# EasyEDA Pro project ProPrj_Attiny1616 Devboard_2024-11-25.epro

# Schematic Schematic1
Board Name: Board1; Create Date: 2024-11-01; Page Name: P1; Project Name: Attiny1616 Devboard; Schematic Name: Schematic1; Update Date: 2024-11-01; Company: EasyEDA.com; Drawn: EasyEDA; Page Size: A4; Part Number: JLCPCB-002; Reviewed: EasyEDA; Version: V0.1
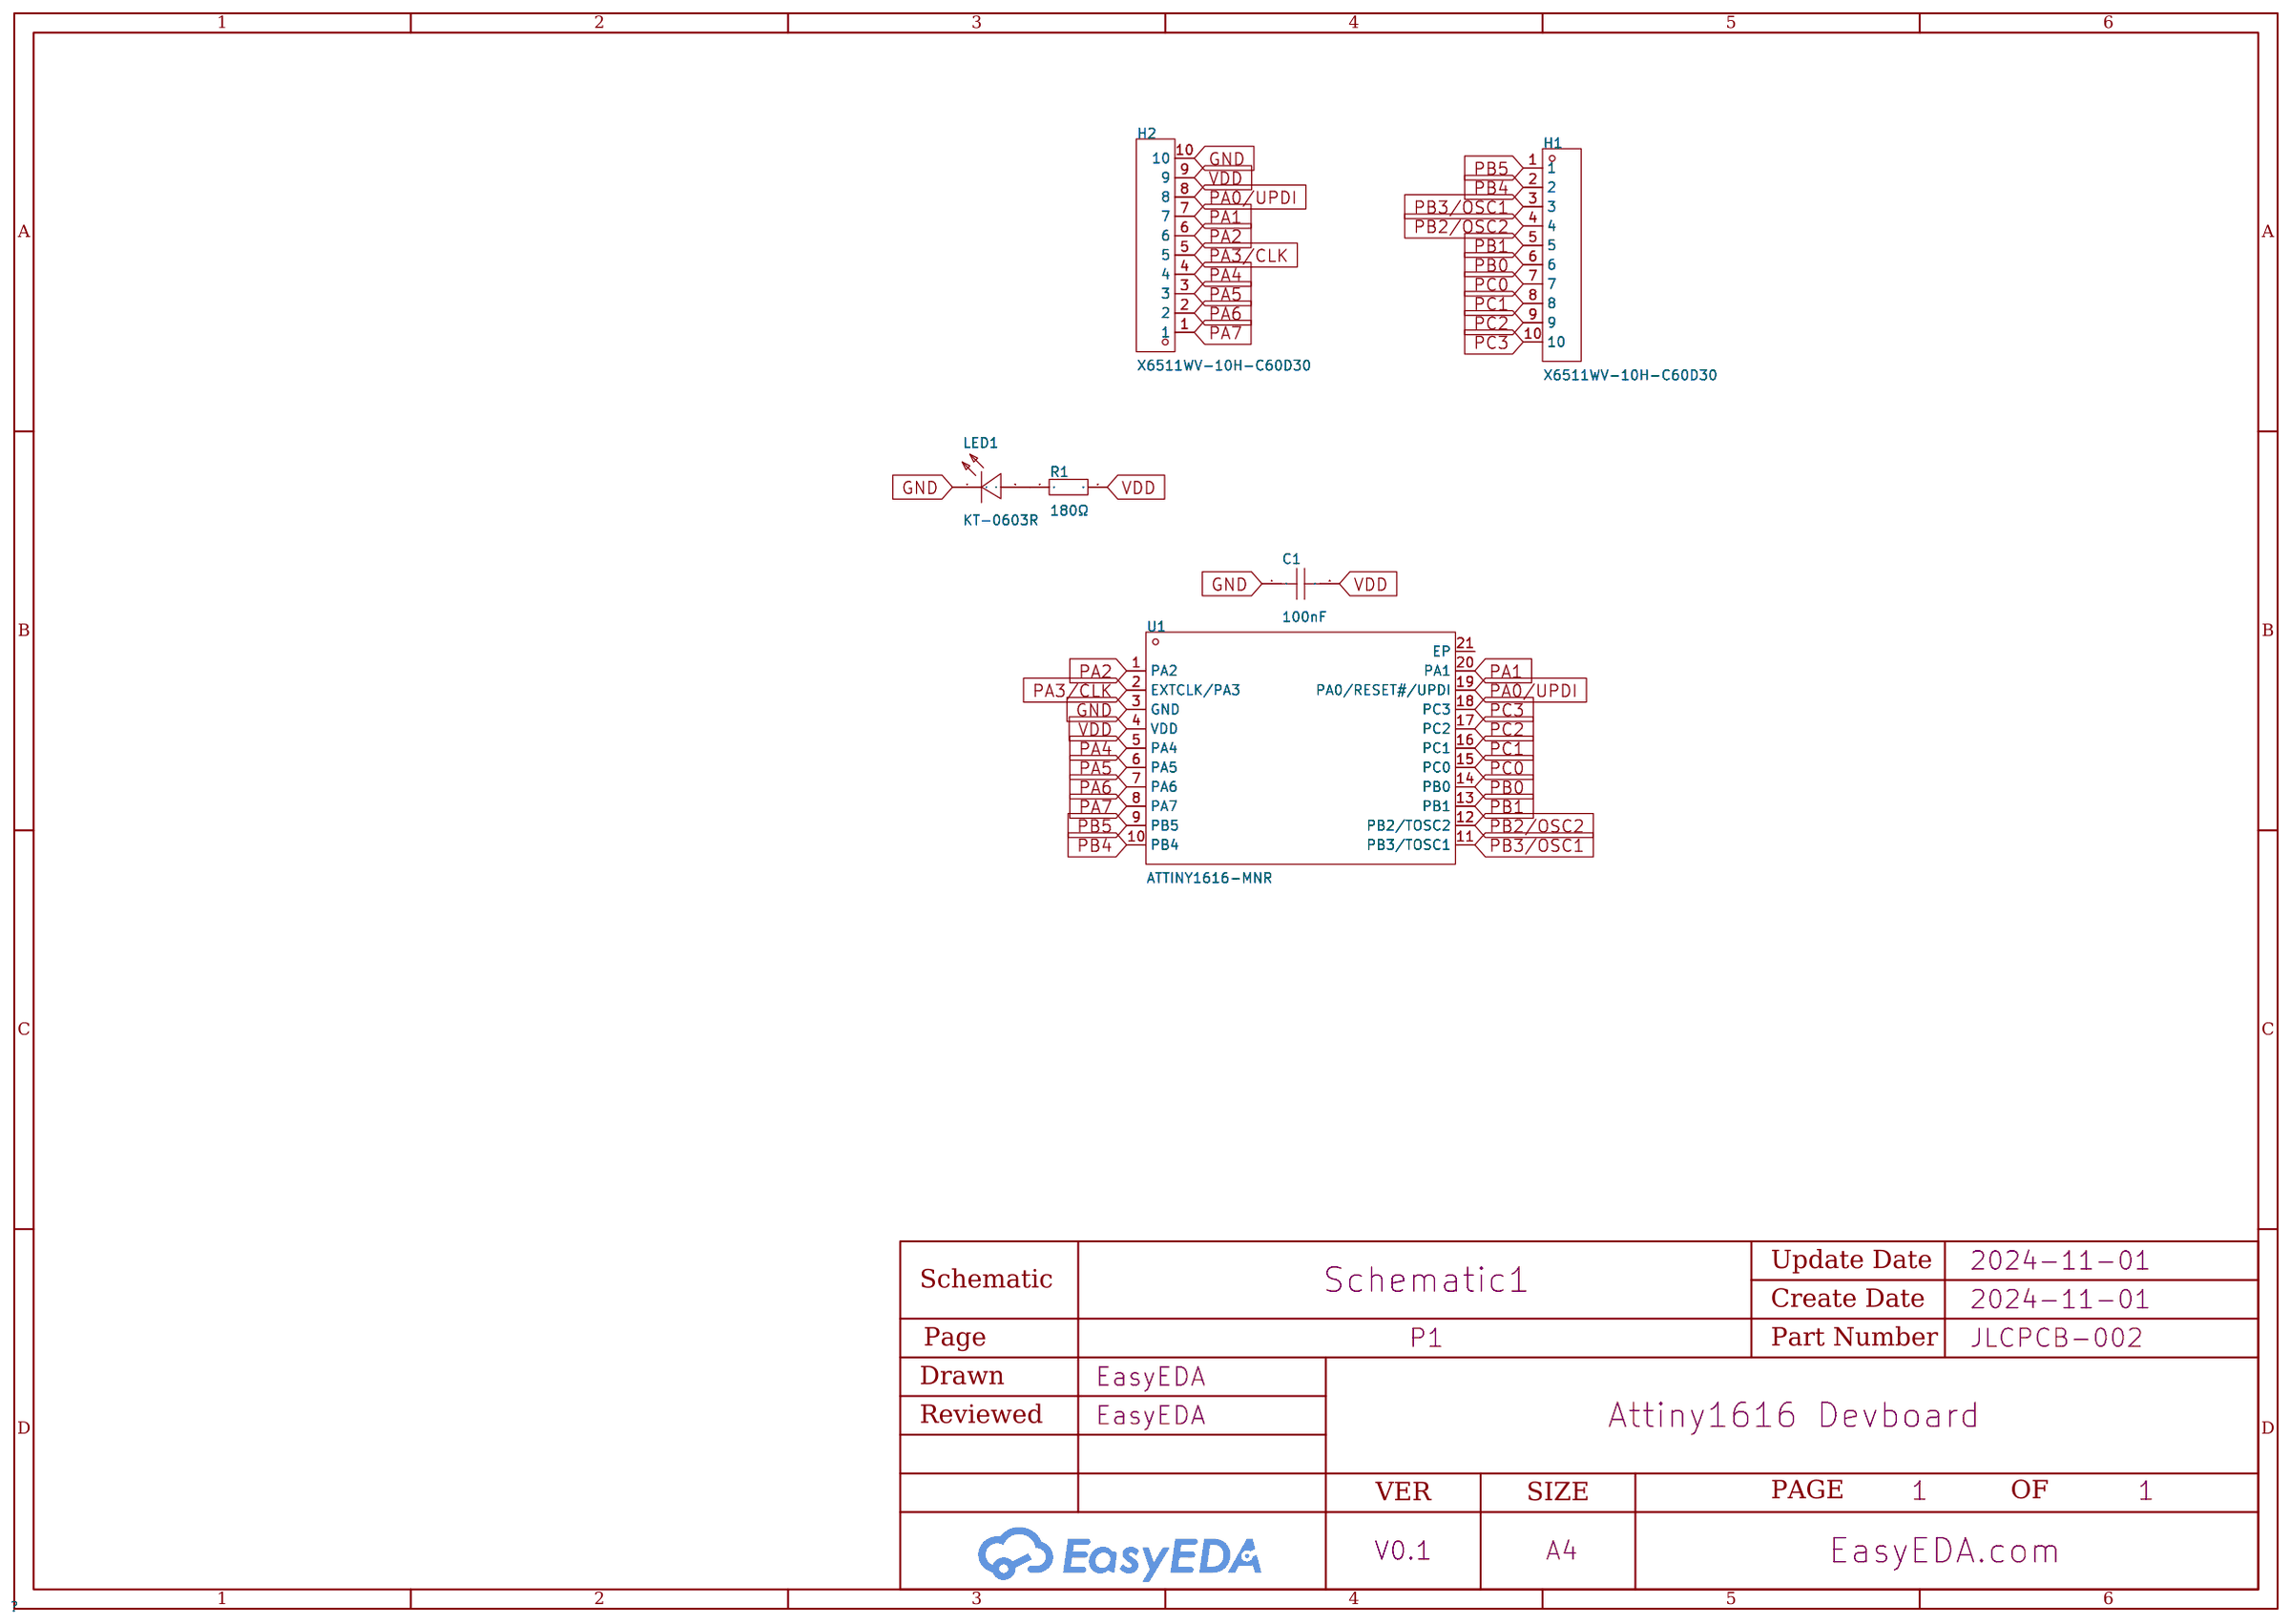
[diagram p0: schematic sheet]

## Parts
C1  100nF  [C0402]
H1  X6511WV-10H-C60D30  [HDR-TH_10P-P2.54-V-M]
H2  X6511WV-10H-C60D30  [HDR-TH_10P-P2.54-V-M]
LED1  KT-0603R  [LED0603-RD]
R1  180Ω  [R0603]
U1  ATTINY1616-MNR  [QFN-20_L3.0-W3.0-P0.40-BL-EP1.7]

## Library data of the parts
C1 = CL05B104KO5NNNC: Capacitance: Tolerance:±10% Tolerance:±10% Voltage Rated: Temperature Coefficient:; LCSC Part Name: 100nF ±10% 16V; Supplier Part: C1525; Manufacturer: SAMSUNG(三星); Supplier Footprint: 0402; JLCPCB Part Class: Basic Part; Datasheet: https://atta.szlcsc.com/upload/public/pdf/source/20160218/1457707763339.pdf; Supplier: LCSC; Tolerance: ±10%
H1 H2 = X6511WV-10H-C60D30: Pin Structure:1x10P Pitch:2.54mm Row Spacing:2.54mm Circluar Pins/Square Pins:Square Pins Mounting Type:- Number of Rows:Plugin Number of Pins:10P Current Rating (Max):3A Voltage Rating (Max):250V Length of Mating Pin:- Insulation Height:2.5mm Length of E; LCSC Part Name: 1x10P 间距:2.54mm 方针; Supplier Part: C706882; Manufacturer: XKB Connection(中国星坤); Supplier Footprint: 插件,P=2.54mm; JLCPCB Part Class: Extended Part; Datasheet: https://atta.szlcsc.com/upload/public/pdf/source/20230721/6983A48291A2C750717C95FB3D973894.pdf; Supplier: LCSC; Pin Structure: 1x10P; Pitch: 2.54mm; Row Spacing: 2.54mm; Circluar Pins/Square Pins: Square Pins; Number of Rows: Plugin; Number of Pins: 10P; Current Rating (Max): 3A; Voltage Rating (Max): 250V; Insulation Height: 2.5mm; Contact Plating: Gold; Operating Temperature Range: -40℃~+105℃; Soldering Temperature(Max): 260℃; Color: Black
LED1 = KT-0603R: Emitted Color:Red Power Dissipation:- Forward Current:- Dominant Wavelength:- Dominant Wavelength:- Peak Wavelength:- Diode Configuration:- Lens Color:- Color Temperature:- Color Temperature:- Viewing Angle:- Mounting Sytle:- Operating Temperature:-40℃~+8; LCSC Part Name: 0603 红灯 高亮; Supplier Part: C2286; Manufacturer: KENTO; Supplier Footprint: 0603; JLCPCB Part Class: Basic Part; Datasheet: https://atta.szlcsc.com/upload/public/pdf/source/20160616/1466072038404.pdf; Supplier: LCSC; Emitted Color: Red; Operating Temperature: -40℃~+85℃
R1 = RC0603FR-07180RL: Type:Thick Film Resistors Resistance: Tolerance:±1% Tolerance:±1% Power(Watts): Overload Voltage (Max): Temperature Coefficient:±100ppm/℃ Temperature Coefficient:±100ppm/℃ Operating Temperature Range:-55℃~+155℃ Operating Temperature Range:-55℃~+155℃; LCSC Part Name: 厚膜电阻 180Ω ±1% 100mW; Supplier Part: C137786; Manufacturer: YAGEO(国巨); Supplier Footprint: 0603; JLCPCB Part Class: Extended Part; Datasheet: https://atta.szlcsc.com/upload/public/pdf/source/20180821/C275644_0D56F95EFF785E7D9A1FEF436B37DA78.pdf; Supplier: LCSC; Type: Thick Film Resistors; Tolerance: ±1%; Temperature Coefficient: ±100ppm/℃; Operating Temperature Range: -55℃~+155℃
U1 = ATTINY1616-MNR: CPU Core:AVR Program Storage Size:16KB RAM Size:2KB GPIO Ports Number:18 Operating Voltage Range:1.8V~5.5V Operating Voltage Range:1.8V~5.5V CPU Maximum Speed:20MHz Program Memory Type:FLASH Operating Temperature Range:-40℃~+105℃ Operating Temperature Ran; Supplier Part: C507118; Manufacturer: MICROCHIP(美国微芯); Supplier Footprint: QFN-20-EP(3x3); JLCPCB Part Class: Extended Part; Datasheet: https://atta.szlcsc.com/upload/public/pdf/source/20200402/C507118_C9B3D13493A25E1DA778A35EE1D23665.pdf; Supplier: LCSC; CPU Core: AVR; Program Storage Size: 16KB; RAM Size: 2KB; GPIO Ports Number: 18; Operating Voltage Range: 1.8V~5.5V; CPU Maximum Speed: 20MHz; Program Memory Type: FLASH; Operating Temperature Range: -40℃~+105℃; ADC (Bit): 10bit; DAC (Bit): 8bit; Peripheral/Function: WDT；PWM; Watchdog: 有; Infrared Data Association: 有; Low-Voltage Detect: 有; Internal Oscillator: 有

## Nets
GND: C1.1 H2.10 LED1.1(K) U1.3(GND)
VDD: C1.2 H2.9 R1.2 U1.4(VDD)
PA0/UPDI: H2.8 U1.19(PA0/RESET#/UPDI)
PA1: H2.7 U1.20(PA1)
PA2: H2.6 U1.1(PA2)
PA3/CLK: H2.5 U1.2(EXTCLK/PA3)
PA4: H2.4 U1.5(PA4)
PA5: H2.3 U1.6(PA5)
PA6: H2.2 U1.7(PA6)
PA7: H2.1 U1.8(PA7)
PB0: H1.6 U1.14(PB0)
PB1: H1.5 U1.13(PB1)
PB2/OSC2: H1.4 U1.12(PB2/TOSC2)
PB3/OSC1: H1.3 U1.11(PB3/TOSC1)
PB4: H1.2 U1.10(PB4)
PB5: H1.1 U1.9(PB5)
PC0: H1.7 U1.15(PC0)
PC1: H1.8 U1.16(PC1)
PC2: H1.9 U1.17(PC2)
PC3: H1.10 U1.18(PC3)
Net-(LED1-2): LED1.2(A) R1.1

Not connected (* = marked no-connect by the designer): U1 21(EP)

# Board PCB1
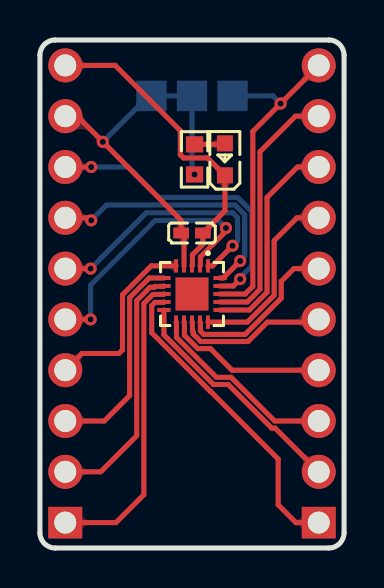
[diagram p1: board, top side]
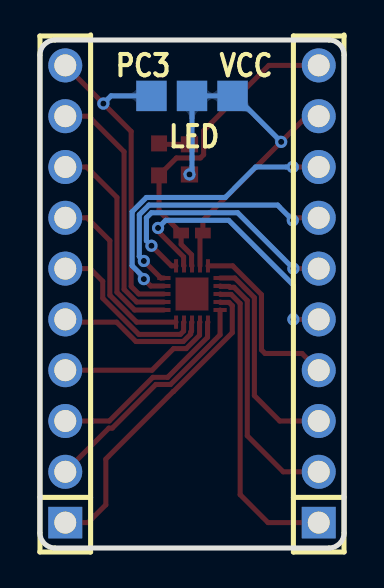
[diagram p2: board, bottom side, seen from below]

Outline 15.24 x 25.4 mm; copper layers: Top Layer, Bottom Layer. Coordinates in mm from the lower left corner of the outline.
Outline path: 0,24.64 0,0.76 arc(0.22,0.22) 0.76,0 14.48,0 arc(15.02,0.22) 15.24,0.76 15.24,24.64 arc(15.02,25.18) 14.48,25.4 0.76,25.4 arc(0.22,25.18) 0,24.64
Stack: Top Layer 0.035mm / Dielectric1 1.51mm FR4 er 4.5 / Bottom Layer 0.035mm

## Design rules (mm)
template: JLCPCB Capability(Two Layers Board)
spacing copperThickness1oz (default): track to track 0.102, other pairs 0.152 to 0.3
spacing copperThickness2oz: track to track 0.203, other pairs 0.152 to 0.3
track width copperThickness1oz (default): min 0.127, default 0.254, max 2.54
track width copperThickness2oz: min 0.203, default 0.254, max 2.54
differential pair differentialPair (default): width min 0.127, default 0.254, max 2.54; gap min 0.152, default 0.152
via viaSize (default): diameter min 0.5, default 0.61, max 10; hole min 0.3, default 0.305, max 6.3

## Placement (name value [footprint] x y rotation side)
C1  100nF  [C0402]  7.62 15.75 180 top
H1  X6511WV-10H-C60D30  [HDR-TH_10P-P2.54-V-M]  13.97 12.7 90 bottom
H2  X6511WV-10H-C60D30  [HDR-TH_10P-P2.54-V-M]  1.27 12.7 90 bottom
NOREF  -  [Pad_e259]  5.59 22.61 0 top
NOREF#2  -  [Pad_e265]  9.65 22.61 0 top
NOREF#3  -  [Pad_e262]  7.62 22.61 0 top
PWR  KT-0603R  [LED0603-RD]  9.27 19.43 90 top
R1  180Ω  [R0603]  7.75 19.43 270 top
U1  ATTINY1616-MNR  [QFN-20_L3.0-W3.0-P0.40-BL-EP1.7]  7.62 12.7 180 top

## Footprints (pads in the part's own frame, mm; a bottom-side part is the same pattern mirrored in y, then rotated)
C0402
  rect 0.79x0.54 smd: 1(-0.545,0) 2(0.545,0)
HDR-TH_10P-P2.54-V-M
  rect 1.575x1.7 hole 1.1: 1(-11.43,0)
  round 1.7 hole 1.1: 2(-8.89,0) 3(-6.35,0) 4(-3.81,0) 5(-1.27,0) 6(1.27,0) 7(3.81,0) 8(6.35,0) 9(8.89,0) 10(11.43,0)
LED0603-RD
  rect 0.8x0.8 smd: 1(-0.799,0) 2(0.799,0)
Pad_e259
  rect 1.524x1.524 smd far side: 1(0,0)
Pad_e262
  rect 1.524x1.524 smd far side: 1(0,0)
Pad_e265
  rect 1.524x1.524 smd far side: 1(0,0)
QFN-20_L3.0-W3.0-P0.40-BL-EP1.7
  rect 0.2x0.665 smd: 1(-0.8,-1.407) 2(-0.4,-1.407) 3(0,-1.407) 4(0.4,-1.407) 5(0.8,-1.407) 11(0.8,1.407) 12(0.4,1.407) 13(0,1.407) 14(-0.4,1.407) 15(-0.8,1.407)
  rect 0.665x0.2 smd: 6(1.407,-0.8) 7(1.407,-0.4) 8(1.407,0) 9(1.407,0.4) 10(1.407,0.8) 16(-1.407,0.8) 17(-1.407,0.4) 18(-1.407,0) 19(-1.407,-0.4) 20(-1.407,-0.8)
  rect 1.65x1.65 smd: 21(0,0)
R0603
  rect 0.806x0.864 smd: 1(-0.753,0) 2(0.753,0)

## Nets
As in the schematic, except:
GND: C1.1 H2.10 PWR.1 U1.3
VDD: C1.2 H2.9 NOREF.1 NOREF#3.1 R1.2 U1.4
PC3: H1.10 NOREF#2.1 U1.18
$1N1900: PWR.2 R1.1

Pads without a net: U1 21

## Via types
v1: diameter 0.61, hole 0.305, Top Layer to Bottom Layer, 11 vias

## Routing (per net, layer and track width the routed paths; a pad name or vN(x,y) marks a point on that pad's centre or on a via; arc(x,y) is an arc through that point)
GND: length 16.2
  Top Layer w0.254: H2.10 3.77,24.13 7.04,20.87 7.04,19.67 7.2,19.5 8.4,19.5 PWR.1 9.27,16.85 C1.1 8.16,15.18 7.64,14.66 7.64,14.13 U1.3
VDD: length 19.7
  Top Layer w0.254: U1.4 7.22,15.6 C1.2 7.08,16.38 v1(3.15,20.31) 1.87,21.59 H2.9
  Bottom Layer w0.254: v1(7.75,18.68) 7.62,18.8 NOREF#3.1 NOREF.1 5.45,22.61 v1(3.15,20.31)
PA0/UPDI: length 15
  Top Layer w0.254: v1(10.03,13.45) 9.69,13.1 U1.19 ; v1(2.57,19.05) H2.8
  Bottom Layer w0.254: v1(2.57,19.05) 4.43,19.05 5.95,17.53 9.91,17.53 10.62,16.81 10.62,14.11 10.03,13.53 v1(10.03,13.45)
PA1: length 13.3
  Top Layer w0.254: H2.7 2.44,16.51 v1(2.57,16.38) ; v1(10.03,14.35) 9.18,13.5 U1.20
  Bottom Layer w0.254: v1(2.57,16.38) 3.33,17.14 9.78,17.14 10.26,16.66 10.26,14.58 v1(10.03,14.35)
PA2: length 13
  Top Layer w0.254: v1(9.65,15.11) 8.65,14.11 U1.1 ; v1(2.54,13.97) H2.6
  Bottom Layer w0.254: v1(2.54,13.97) 5.33,16.76 9.65,16.76 9.91,16.51 9.91,15.37 v1(9.65,15.11)
PA3/CLK: length 13.7
  Top Layer w0.254: v1(9.32,16) 9.32,15.84 8.04,14.56 8.04,14.13 U1.2 ; v1(2.54,11.43) H2.5
  Bottom Layer w0.254: v1(9.32,16) 8.94,16.38 5.78,16.38 2.54,13.14 v1(2.54,11.43)
PA4: length 9.3
  Top Layer w0.254: H2.4 2.11,9.73 3.96,9.73 4.14,9.91 4.14,12.67 5.58,14.11 U1.5
PA5: length 10.8
  Top Layer w0.254: H2.3 3.22,6.35 4.5,7.62 4.5,12.52 5.48,13.5 U1.6
PA6: length 12.8
  Top Layer w0.254: U1.7 6.19,13.08 5.76,13.08 5.72,13.03 5.51,13.03 4.85,12.37 4.85,5.61 3.05,3.81 H2.2
PA7: length 15.3
  Top Layer w0.254: U1.8 6.19,12.68 5.66,12.68 5.21,12.23 5.21,2.67 3.81,1.27 H2.1
PB0: length 8.3
  Top Layer w0.254: U1.14 8.04,11.27 8.04,10.84 8.2,10.68 10.28,10.68 12.09,12.49 12.09,13.34 12.73,13.97 H1.6
PB1: length 7.5
  Top Layer w0.254: H1.5 13.83,11.29 11.4,11.29 10.43,10.33 8.06,10.33 7.69,10.7 7.69,10.8 7.64,10.84 7.64,11.27 U1.13
PB2/OSC2: length 8.1
  Top Layer w0.254: U1.12 7.24,11.27 7.24,10.64 7.91,9.97 8.54,9.97 9.62,8.89 H1.4
PB3/OSC1: length 9.6
  Top Layer w0.254: H1.3 11.76,6.35 9.58,8.53 8.84,8.53 6.84,10.53 6.84,11.27 U1.11
PB4: length 11.8
  Top Layer w0.254: U1.10 6.21,10.66 8.69,8.18 9.43,8.18 11.62,5.99 11.79,5.99 H1.2
PB5: length 15.7
  Top Layer w0.254: U1.9 6.19,12.28 5.76,12.28 5.6,12.12 5.6,10.77 8.55,7.82 8.56,7.82 11.94,4.45 11.94,2.16 12.83,1.27 H1.1
PC0: length 9.3
  Top Layer w0.254: U1.15 10.39,11.29 11.74,12.64 11.74,15.37 12.88,16.51 H1.7
PC1: length 10.7
  Top Layer w0.254: U1.16 10.49,11.9 11.38,12.79 11.38,17.53 12.9,19.05 H1.8
PC2: length 12.8
  Top Layer w0.254: U1.17 10.39,12.3 11.02,12.93 11.02,19.81 12.8,21.59 H1.9
PC3: length 16.8
  Top Layer w0.254: H1.10 v1(12.06,22.22) 10.67,20.83 10.67,13.08 10.29,12.7 U1.18
  Bottom Layer w0.254: NOREF#2.1 11.68,22.61 v1(12.06,22.22)
$1N1900: length 1.5
  Top Layer w0.254: R1.1 9.22,20.18 PWR.2

Small or netless copper shapes (teardrops, artwork), in the pictures only: 38 on Top Layer, 12 on Bottom Layer

## Text on the board
Bottom Silkscreen Layer: VCC | LED | PC3
